# Altium project Audio_EDU_Mini.PrjPcb (part 1 of 3)
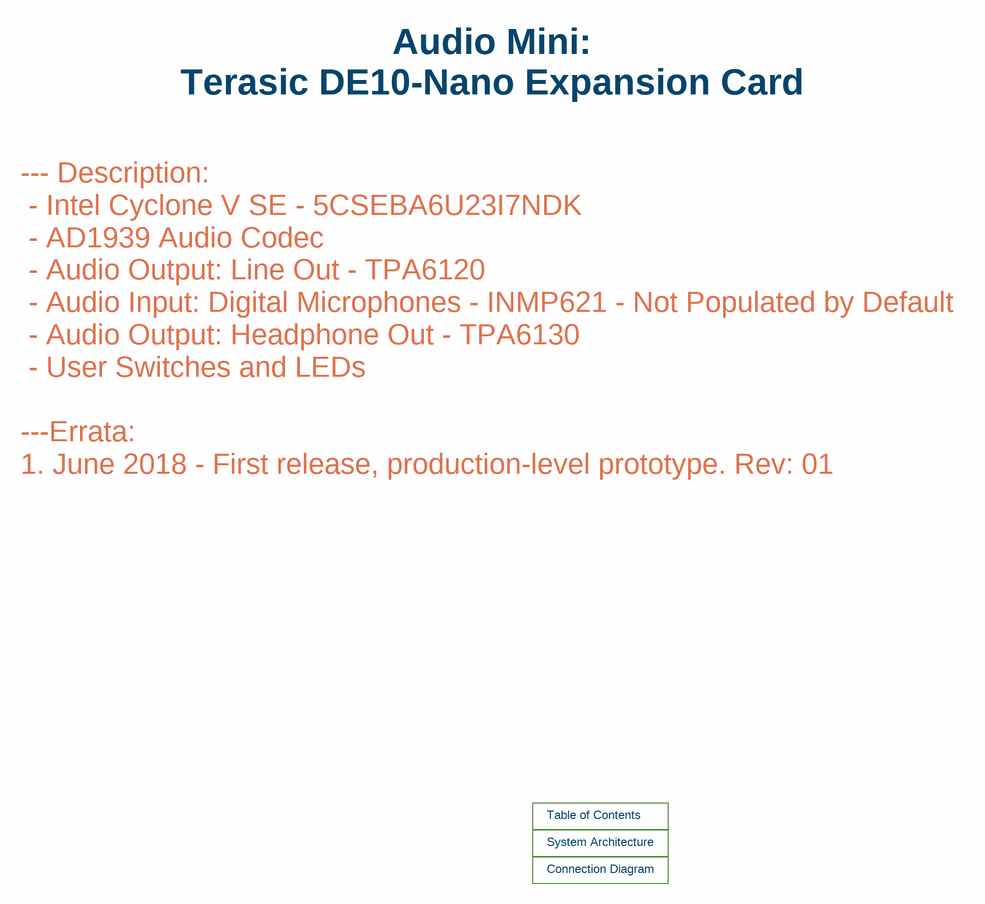
[diagram p0: Errata+TOC.SchDoc]
PCB_Name: Audio_Mini_Bare_PCB; PCB_Revision: 1.0
11 sheets, 134 parts. Net scope: flat (ports and power ports of the same name join across sheets).
Board file: Audio_EDU_Mini_Rev1_0.PcbDoc
Sheets:
  Errata+TOC.SchDoc
    Table of Contents = ToC.SchDoc
    Connection Diagram = TopLevel.SchDoc
      DIGITAL MICROPHONES* = Audio_Input_Digitial_Mic.SchDoc
      3.5mm HEADPHONE OUTPUT = Audio_Output_Headphone.SchDoc
      SUPPORT = Support.SchDoc
      FPGA CONNECTORS = FPGA_Connectors.SchDoc
      3.5mm LINE IN = Audio_Input_Line_In.SchDoc
      AUDIO CODEC = Audio_Codec.SchDoc
      POWER = Power.SchDoc
    System Architecture = System_Architecture.SchDoc

## Sheet Errata+TOC.SchDoc: Errata and Table of Contents
size 279 x 215 mm; DrawnBy: Connor Dack; Engineer: Connor Dack; DocumentNumber: 1; Revision: 1.0; SheetNumber: 1; SheetTotal: 11

### Sub-sheets
Connection Diagram = TopLevel.SchDoc: no entries
System Architecture = System_Architecture.SchDoc: no entries
Table of Contents = ToC.SchDoc: no entries

### Notes on the sheet
- Audio Mini:
  Terasic DE10-Nano Expansion Card
- --- Description:
  - Intel Cyclone V SE - 5CSEBA6U23I7NDK
  - AD1939 Audio Codec
  - Audio Output: Line Out - TPA6120
  - Audio Input: Digital Microphones - INMP621 - Not Populated by Default
  - Audio Output: Headphone Out - TPA6130
  - User Switches and LEDs
  ---Errata:
  1. June 2018 - First release, production-level prototype. Rev: 01
- Title:
- Rev:
- Sheet:
- Date:
- of
- Time:
- Size:
- 11 x 8.5 Inches
- Engineer:
- File:
- This document contains confidential and proprietary information belonging to flat earth of Bozeman, Montana.
  This information can not be disclosed to anyone outside of flat earth without written permission from flat earth.

## Sheet ToC.SchDoc: Table of Contents
size 279 x 215 mm; CompanyName: Flat Earth Inc.; DrawnBy: Connor Dack; Engineer: Connor Dack; Address1: 985 Technology Blvd; Address2: Suite 102; Address3: Bozeman, MT, 59718; DocumentNumber: 2; Revision: 0.0; SheetNumber: 2; SheetTotal: 11
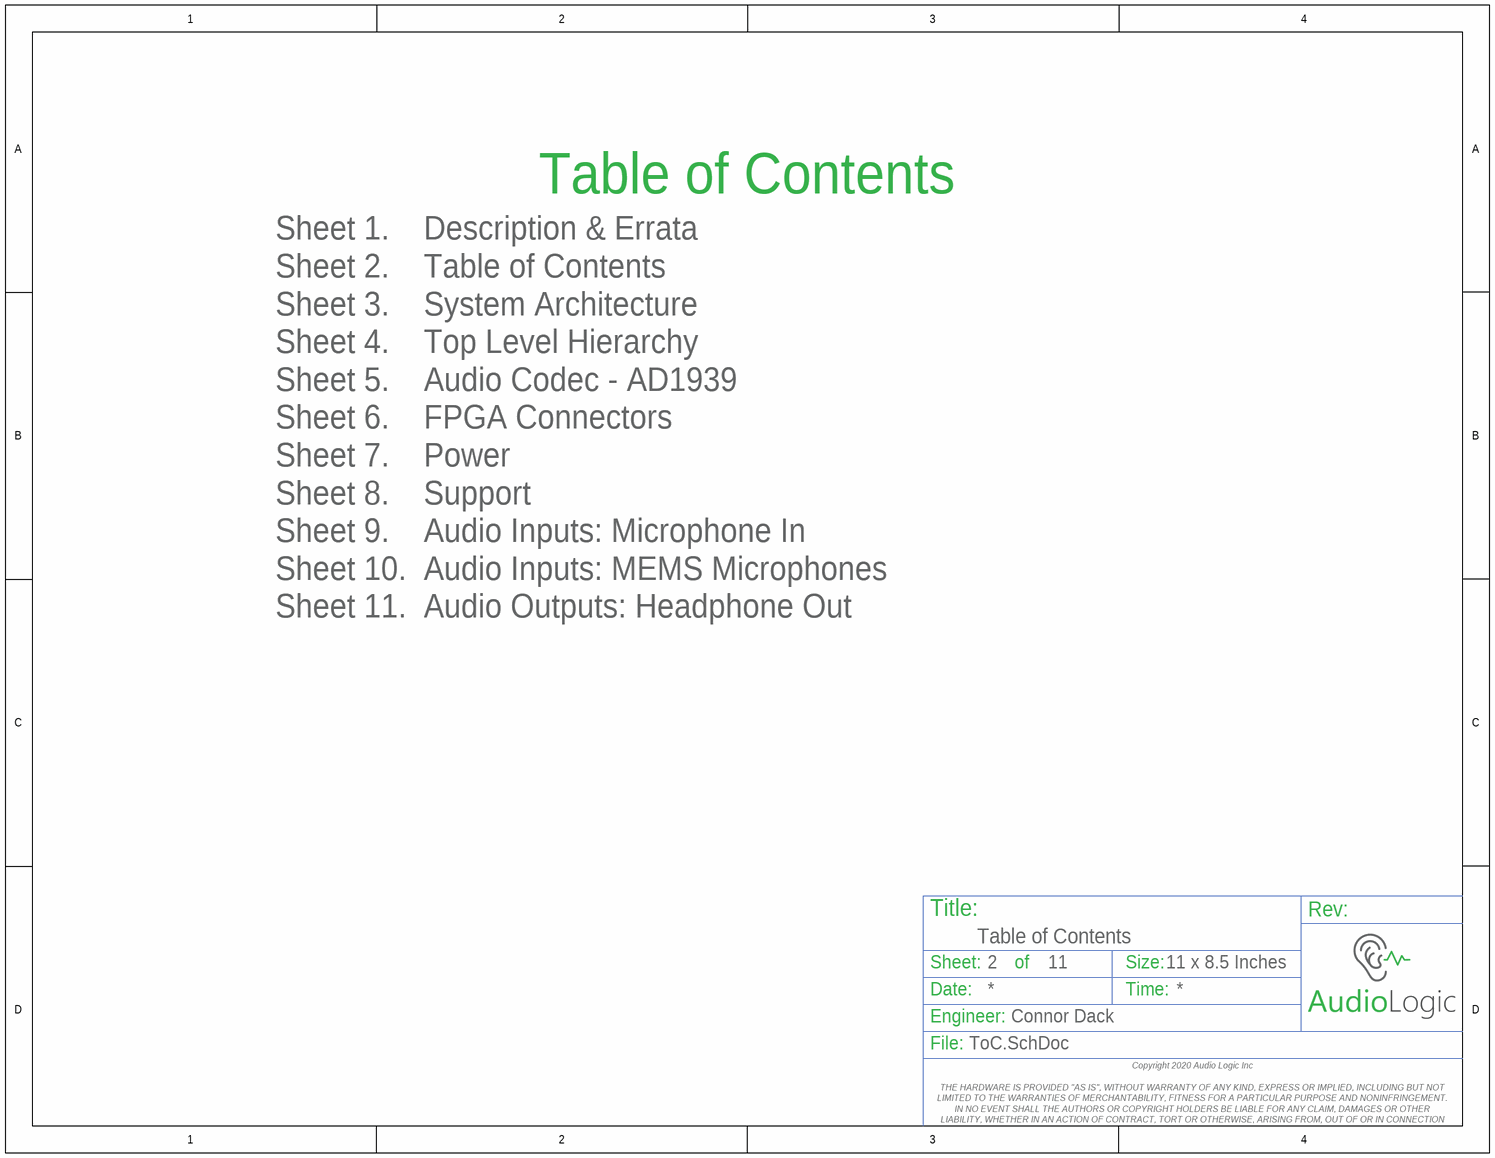
[diagram p1: ToC.SchDoc]

### Notes on the sheet
- Table of Contents
- Sheet 1.    Description & Errata
  Sheet 2.    Table of Contents
  Sheet 3.    System Architecture
  Sheet 4.    Top Level Hierarchy
  Sheet 5.    Audio Codec - AD1939
  Sheet 6.    FPGA Connectors
  Sheet 7.    Power
  Sheet 8.    Support
  Sheet 9.    Audio Inputs: Microphone In
  Sheet 10.  Audio Inputs: MEMS Microphones
  Sheet 11.  Audio Outputs: Headphone Out
- Title:
- Sheet:
- of
- Size:
- 11 x 8.5 Inches
- Rev:
- Date:
- Engineer:
- Time:
- File:
- Copyright 2020 Audio Logic Inc
  THE HARDWARE IS PROVIDED "AS IS", WITHOUT WARRANTY OF ANY KIND, EXPRESS OR IMPLIED, INCLUDING BUT NOT LIMITED TO THE WARRANTIES OF MERCHANTABILITY, FITNESS FOR A PARTICULAR PURPOSE AND NONINFRINGEMENT. IN NO EVENT SHALL THE AUTHORS OR COPYRIGHT HOLDERS BE LIABLE FOR ANY CLAIM, DAMAGES OR OTHER LIABILITY, WHETHER IN AN ACTION OF CONTRACT, TORT OR OTHERWISE, ARISING FROM, OUT OF OR IN CONNECTION WITH THE HARDWARE OR THE USE OR OTHER DEALINGS IN THE HARDWARE.

## Sheet TopLevel.SchDoc: Top Level Hierarchy
size 279 x 215 mm; DrawnBy: Connor Dack; DocumentNumber: 4; Revision: 1.0; SheetNumber: 4; SheetTotal: 11
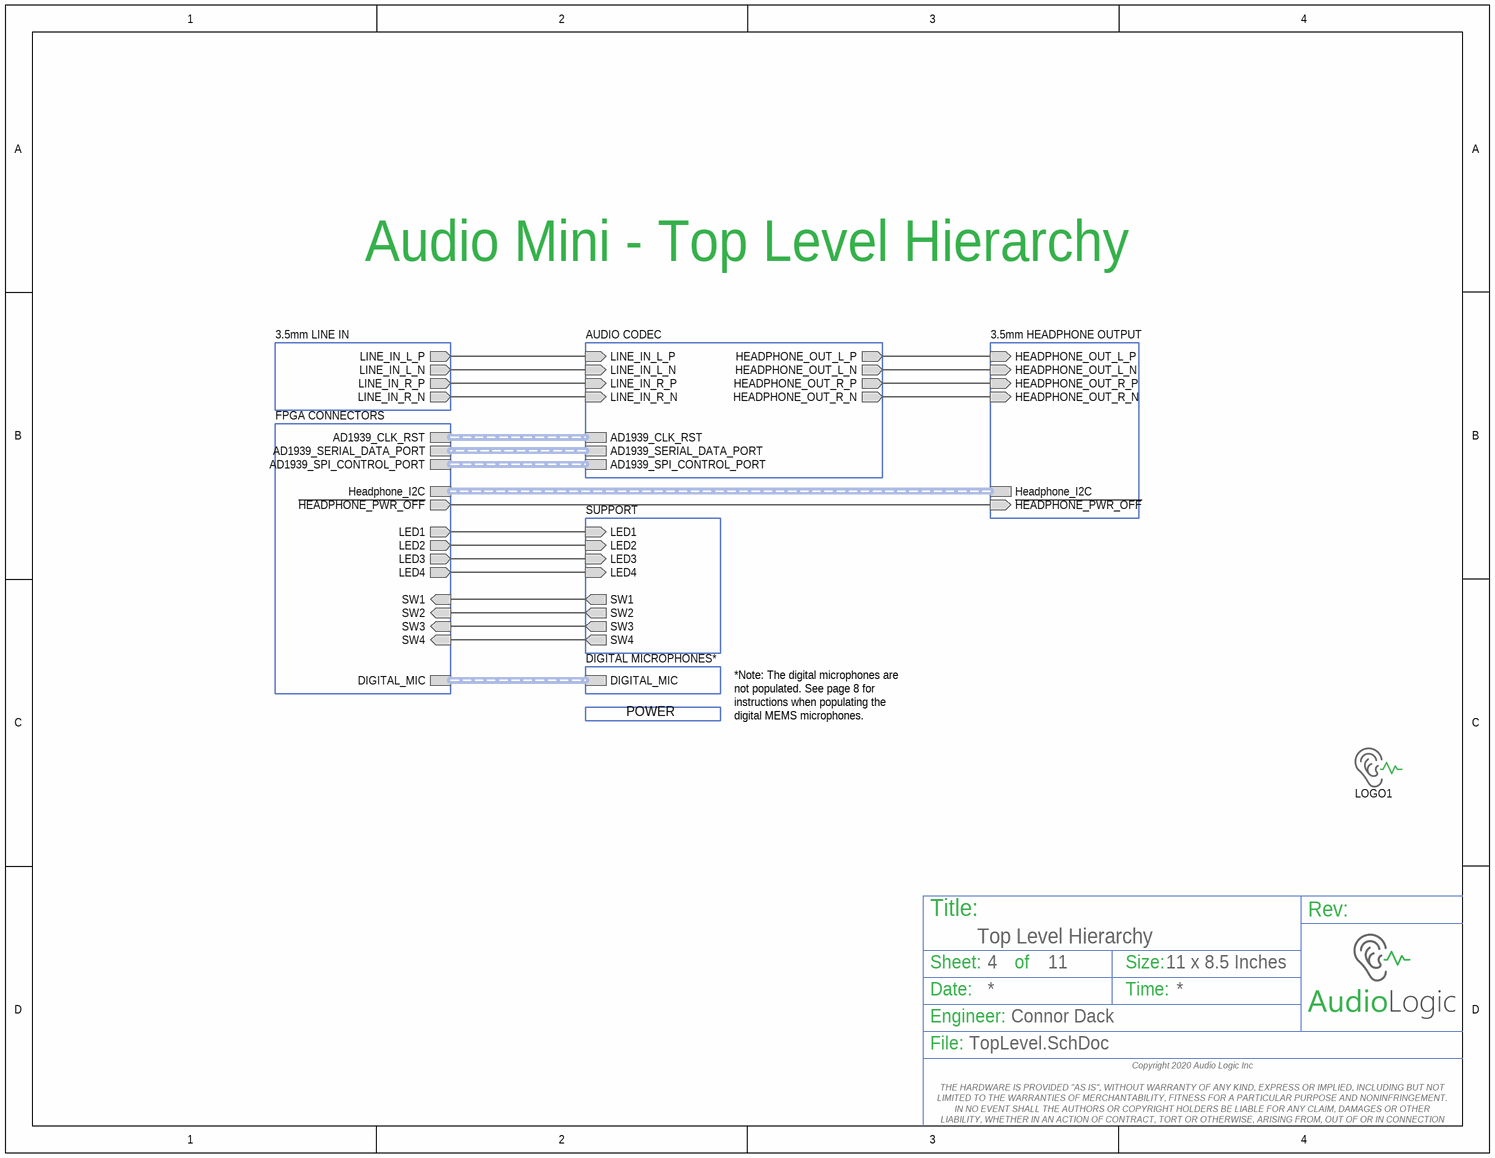
[diagram p2: TopLevel.SchDoc]

### Parts
LOGO1  Audio Logic Logo  [AL_Logo_Small_Silkscreen]  (value not drawn)  (no BOM)

### Sub-sheets
3.5mm HEADPHONE OUTPUT = Audio_Output_Headphone.SchDoc: HEADPHONE_OUT_R_N (in), HEADPHONE_OUT_R_P (in), HEADPHONE_OUT_L_N (in), HEADPHONE_OUT_L_P (in), ~{HEADPHONE_PWR_OFF} (in), Headphone_I2C (harness I2C_Headphone)
3.5mm LINE IN = Audio_Input_Line_In.SchDoc: LINE_IN_R_P (out), LINE_IN_R_N (out), LINE_IN_L_P (out), LINE_IN_L_N (out)
AUDIO CODEC = Audio_Codec.SchDoc: HEADPHONE_OUT_R_N (out), HEADPHONE_OUT_R_P (out), HEADPHONE_OUT_L_N (out), HEADPHONE_OUT_L_P (out), LINE_IN_R_P (in), LINE_IN_R_N (in), LINE_IN_L_P (in), LINE_IN_L_N (in), AD1939_CLK_RST (harness AD1939_CLK_RST), AD1939_SERIAL_DATA_PORT (harness AD19319_Serial_Data_Port), AD1939_SPI_CONTROL_PORT (harness SPI_Audio_Codec)
DIGITAL MICROPHONES* = Audio_Input_Digitial_Mic.SchDoc: DIGITAL_MIC (harness Digital_Mic)
FPGA CONNECTORS = FPGA_Connectors.SchDoc: SW1 (in), SW3 (in), SW2 (in), SW4 (in), LED1 (out), LED2 (out), LED3 (out), LED4 (out), DIGITAL_MIC (harness Digital_Mic), Headphone_I2C (harness I2C_Headphone), ~{HEADPHONE_PWR_OFF} (out), AD1939_SPI_CONTROL_PORT (harness SPI_Audio_Codec), AD1939_SERIAL_DATA_PORT (harness AD19319_Serial_Data_Port), AD1939_CLK_RST (harness AD1939_CLK_RST)
POWER = Power.SchDoc: no entries
SUPPORT = Support.SchDoc: SW1 (out), SW2 (out), SW3 (out), SW4 (out), LED1 (in), LED2 (in), LED3 (in), LED4 (in)

### Nets
(unnamed): sheet 3.5mm HEADPHONE OUTPUT/HEADPHONE_OUT_R_N, sheet AUDIO CODEC/HEADPHONE_OUT_R_N
(unnamed): sheet 3.5mm HEADPHONE OUTPUT/HEADPHONE_OUT_R_P, sheet AUDIO CODEC/HEADPHONE_OUT_R_P
(unnamed): sheet 3.5mm HEADPHONE OUTPUT/HEADPHONE_OUT_L_N, sheet AUDIO CODEC/HEADPHONE_OUT_L_N
(unnamed): sheet 3.5mm HEADPHONE OUTPUT/HEADPHONE_OUT_L_P, sheet AUDIO CODEC/HEADPHONE_OUT_L_P
(unnamed): sheet 3.5mm HEADPHONE OUTPUT/~{HEADPHONE_PWR_OFF}, sheet FPGA CONNECTORS/~{HEADPHONE_PWR_OFF}
(unnamed): sheet SUPPORT/SW1, sheet FPGA CONNECTORS/SW1
(unnamed): sheet SUPPORT/SW2, sheet FPGA CONNECTORS/SW2
(unnamed): sheet SUPPORT/SW3, sheet FPGA CONNECTORS/SW3
(unnamed): sheet SUPPORT/SW4, sheet FPGA CONNECTORS/SW4
(unnamed): sheet SUPPORT/LED1, sheet FPGA CONNECTORS/LED1
(unnamed): sheet SUPPORT/LED2, sheet FPGA CONNECTORS/LED2
(unnamed): sheet SUPPORT/LED3, sheet FPGA CONNECTORS/LED3
(unnamed): sheet SUPPORT/LED4, sheet FPGA CONNECTORS/LED4
(unnamed): sheet 3.5mm LINE IN/LINE_IN_R_P, sheet AUDIO CODEC/LINE_IN_R_P
(unnamed): sheet 3.5mm LINE IN/LINE_IN_R_N, sheet AUDIO CODEC/LINE_IN_R_N
(unnamed): sheet 3.5mm LINE IN/LINE_IN_L_P, sheet AUDIO CODEC/LINE_IN_L_P
(unnamed): sheet 3.5mm LINE IN/LINE_IN_L_N, sheet AUDIO CODEC/LINE_IN_L_N

### Buses and harness runs
harness sheet 3.5mm HEADPHONE OUTPUT/Headphone_I2C = sheet FPGA CONNECTORS/Headphone_I2C
harness sheet AUDIO CODEC/AD1939_CLK_RST = sheet FPGA CONNECTORS/AD1939_CLK_RST
harness sheet AUDIO CODEC/AD1939_SERIAL_DATA_PORT = sheet FPGA CONNECTORS/AD1939_SERIAL_DATA_PORT
harness sheet AUDIO CODEC/AD1939_SPI_CONTROL_PORT = sheet FPGA CONNECTORS/AD1939_SPI_CONTROL_PORT
harness sheet DIGITAL MICROPHONES*/DIGITAL_MIC = sheet FPGA CONNECTORS/DIGITAL_MIC

### Notes on the sheet
- Audio Mini - Top Level Hierarchy
- *Note: The digital microphones are not populated. See page 8 for instructions when populating the digital MEMS microphones.
- Title:
- Sheet:
- of
- Size:
- 11 x 8.5 Inches
- Rev:
- Date:
- Engineer:
- Time:
- File:
- Copyright 2020 Audio Logic Inc
  THE HARDWARE IS PROVIDED "AS IS", WITHOUT WARRANTY OF ANY KIND, EXPRESS OR IMPLIED, INCLUDING BUT NOT LIMITED TO THE WARRANTIES OF MERCHANTABILITY, FITNESS FOR A PARTICULAR PURPOSE AND NONINFRINGEMENT. IN NO EVENT SHALL THE AUTHORS OR COPYRIGHT HOLDERS BE LIABLE FOR ANY CLAIM, DAMAGES OR OTHER LIABILITY, WHETHER IN AN ACTION OF CONTRACT, TORT OR OTHERWISE, ARISING FROM, OUT OF OR IN CONNECTION WITH THE HARDWARE OR THE USE OR OTHER DEALINGS IN THE HARDWARE.

### Library data of the parts
LOGO1 = Audio_Logic_Logo

## Sheet Audio_Input_Digitial_Mic.SchDoc: MEMS Microphones
size 279 x 215 mm; DrawnBy: Connor Dack; Engineer: Connor Dack; DocumentNumber: 10; Revision: 1.0; SheetNumber: 10; SheetTotal: 11
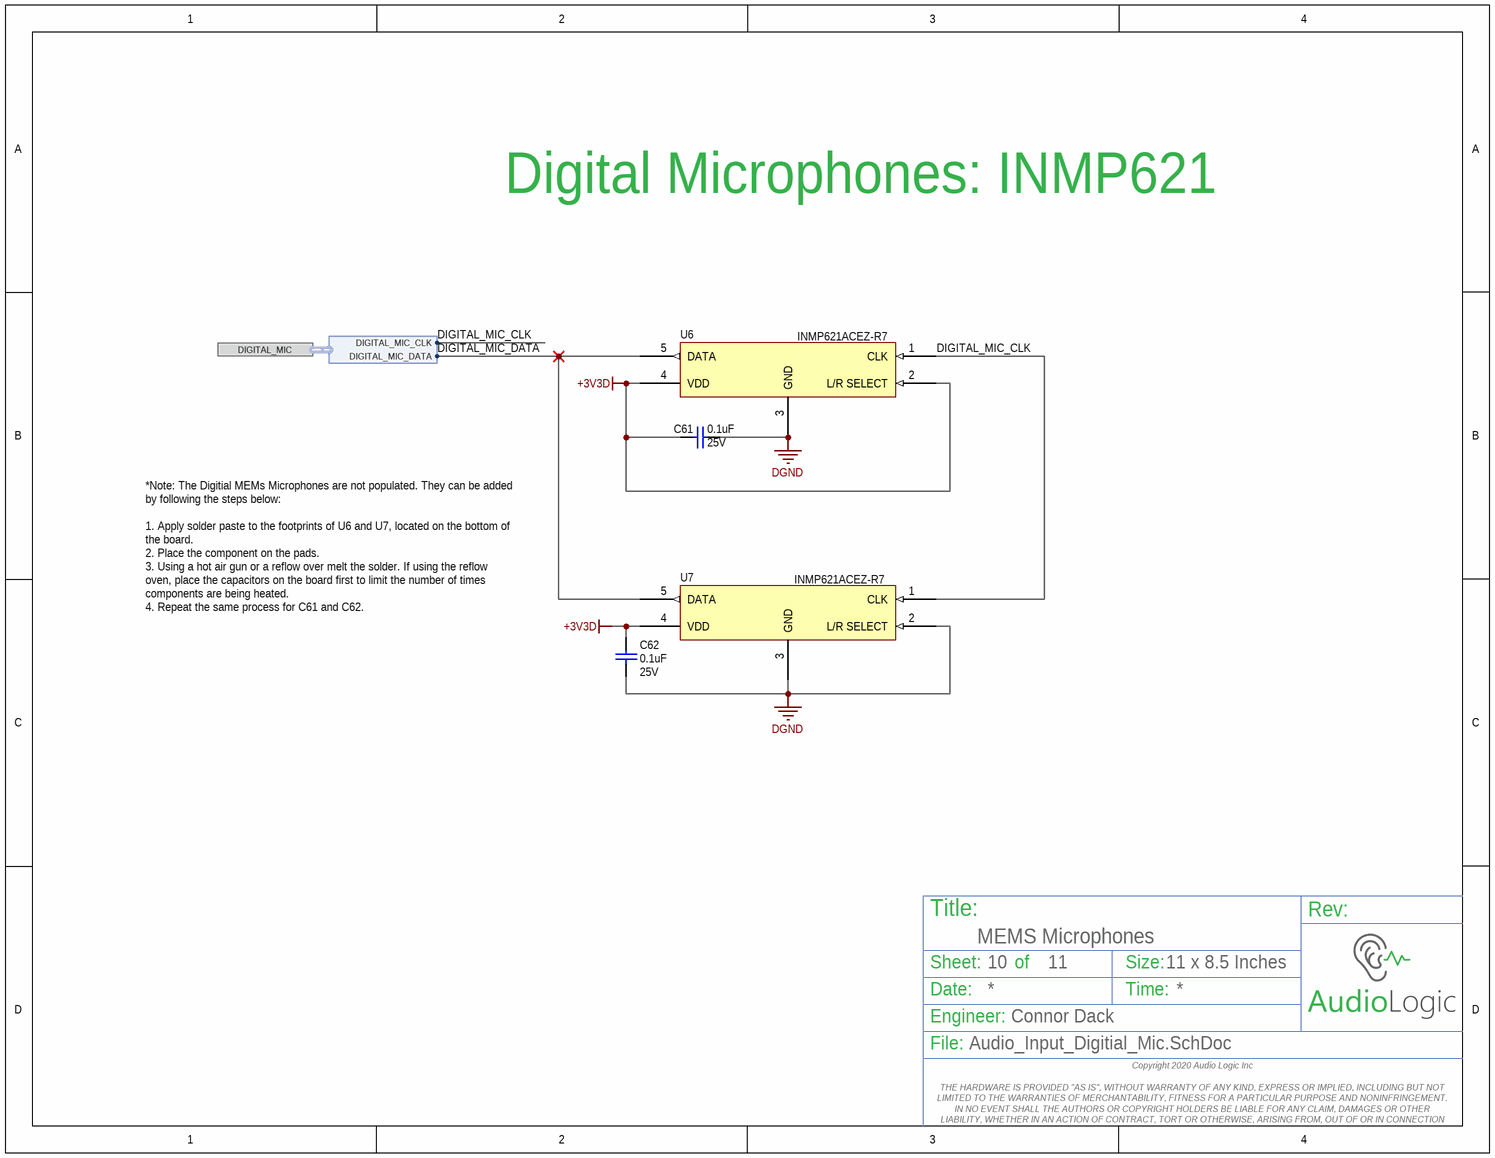
[diagram p3: Audio_Input_Digitial_Mic.SchDoc]

### Parts
C61  Voltage Rating: 25V  Capacitance: 0.1uF  [3-0603_L_DNP]  (hidden comment: CGA3E2X7R1E104K080AA)
C62  Voltage Rating: 25V  Capacitance: 0.1uF  [3-0603_L_DNP]  (hidden comment: CGA3E2X7R1E104K080AA)
U6  Manufacturer Part Number: INMP621ACEZ-R7  [INMP621_DNP]  (hidden comment: INMP621)
U7  Manufacturer Part Number: INMP621ACEZ-R7  [INMP621_DNP]  (hidden comment: INMP621)

### Ports
DIGITAL_MIC (harness Digital_Mic)

### Harnesses
Digital_Mic: DIGITAL_MIC_CLK, DIGITAL_MIC_DATA

### Nets
+3V3D: C61.2 C62.1 U6.2(L/R_SELECT) U6.4(VDD) U7.4(VDD)
DGND: C61.1 C62.2 U6.3(GND) U7.2(L/R_SELECT) U7.3(GND)  [project net AGND]
DIGITAL_MIC_CLK: U6.1(CLK) U7.1(CLK) ; port DIGITAL_MIC.DIGITAL_MIC_CLK
DIGITAL_MIC_DATA: U6.5(DATA) U7.5(DATA) ; port DIGITAL_MIC.DIGITAL_MIC_DATA

### Notes on the sheet
- Digital Microphones: INMP621
- *Note: The Digitial MEMs Microphones are not populated. They can be added by following the steps below:
  1. Apply solder paste to the footprints of U6 and U7, located on the bottom of the board.
  2. Place the component on the pads.
  3. Using a hot air gun or a reflow over melt the solder. If using the reflow oven, place the capacitors on the board first to limit the number of times components are being heated.
  4. Repeat the same process for C61 and C62.
- Title:
- Sheet:
- of
- Size:
- 11 x 8.5 Inches
- Rev:
- Date:
- Engineer:
- Time:
- File:
- Copyright 2020 Audio Logic Inc
  THE HARDWARE IS PROVIDED "AS IS", WITHOUT WARRANTY OF ANY KIND, EXPRESS OR IMPLIED, INCLUDING BUT NOT LIMITED TO THE WARRANTIES OF MERCHANTABILITY, FITNESS FOR A PARTICULAR PURPOSE AND NONINFRINGEMENT. IN NO EVENT SHALL THE AUTHORS OR COPYRIGHT HOLDERS BE LIABLE FOR ANY CLAIM, DAMAGES OR OTHER LIABILITY, WHETHER IN AN ACTION OF CONTRACT, TORT OR OTHERWISE, ARISING FROM, OUT OF OR IN CONNECTION WITH THE HARDWARE OR THE USE OR OTHER DEALINGS IN THE HARDWARE.

### Library data of the parts
C61 C62 = CGA3E2X7R1E104K080AA: CAP CER 0.1UF 25V X7R 0603; Manufacturer: TDK; Tolerance: 10%; ComponentLink1URL: https://datasheet.ciiva.com/24218/cga3e2x7r1h332k080aa-266003-24218741.pdf; ComponentLink1Description: https://datasheet.ciiva.com/24218/cga3e2x7r1h332k080aa-266003-24218741.pdf; Supplier 1: Digi-Key; Manufacturer Part Number: CGA3E2X7R1E104K080AA; Stock 1: 170098; Pricing 1: 1=0.1, 10=0.063, 100=0.0279, 500=0.0199, 1000=0.0156 (USD); Mount: Surface Mount; Case/Package: 0603; Weight: 7.1E-05oz; Case Code (Metric): 1608; Case Code (Imperial): 0603; Min Operating Temperature: -55°C; Max Operating Temperature: 125°C; Packaging: Tape and Reel; Package Quantity: 1; Voltage Rating (DC): 25V; Dielectric: X7R; Termination: SMD/SMT; Composition: Ceramic; Length: 1.6mm; Height: 0.8mm; Width: 0.031inch; Thickness: 0.035inch; Depth: 0.8mm; REACH SVHC: No SVHC; Lead Free: Lead Free; ComponentLink2URL: https://datasheet.ciiva.com/22725/1735392-22725638.pdf; ComponentLink2Description: https://datasheet.ciiva.com/22725/1735392-22725638.pdf; ComponentLink3URL: https://datasheet.ciiva.com/24220/cga3e2x7r1e104k080aa-265934-24220022.pdf; ComponentLink3Description: https://datasheet.ciiva.com/24220/cga3e2x7r1e104k080aa-265934-24220022.pdf; ComponentLink4URL: https://datasheet.ciiva.com/22725/1735392-22725639.pdf; ComponentLink4Description: https://datasheet.ciiva.com/22725/1735392-22725639.pdf; ComponentLink5URL: https://datasheet.ciiva.com/16427/mlccspec-automotive-general-midvoltage-en-16427320.pdf; ComponentLink5Description: https://datasheet.ciiva.com/16427/mlccspec-automotive-general-midvoltage-en-16427320.pdf; ComponentLink6URL: https://datasheet.ciiva.com/23803/1735392-23803082.pdf; ComponentLink6Description: https://datasheet.ciiva.com/23803/1735392-23803082.pdf; Supplier Part Number 1: 445-5667-6-ND; Load Status: *
U6 U7 = INMP621: 45Hz ~ 20kHz Digital, PDM Microphone MEMS (Silicon) Omnidirectional (-46dB ±2dB @ 94dB SPL) Solder Pads; Manufacturer: InvenSense; S/N Ratio: 65dB; Voltage Range: 1.62 ~ 3.63V; Current - Supply: 1.6mA; Port Location: Bottom; Seal Rating: None; Shape: Rectangular; Supplier 1: Digi-Key; RoHS: RoHS Compliant; Category: Audio Products; Stock 1: 1211; Pricing 1: 1=2.88, 10=2.491, 25=2.2292, 50=1.9668, 100=1.9012, 250=1.83568, 500=1.77012 (USD); Packaging: Cut Tape (CT); Part Status: Active; Type: MEMS (Silicon); Output Type: Digital, PDM; Direction: Omnidirectional; Frequency Range: 45Hz ~ 20kHz; Sensitivity: -46dB ±2dB @ 94dB SPL; Impedance: -; Voltage - Rated: -; Termination: Solder Pads; Size / Dimension: 4.00mm L x 3.00mm W; Height (Max): 1.10mm; ComponentLink1URL: https://www.invensense.com/wp-content/uploads/2015/02/INMP621.pdf; ComponentLink1Description: https://www.invensense.com/wp-content/uploads/2015/02/INMP621.pdf; Supplier Part Number 1: 1428-1018-1-ND; Load Status: *

## Sheet Audio_Output_Headphone.SchDoc: Heaphone Out
size 279 x 215 mm; DrawnBy: Connor Dack; Engineer: Connor Dack; DocumentNumber: 11; Revision: 1.0; SheetNumber: 11; SheetTotal: 11
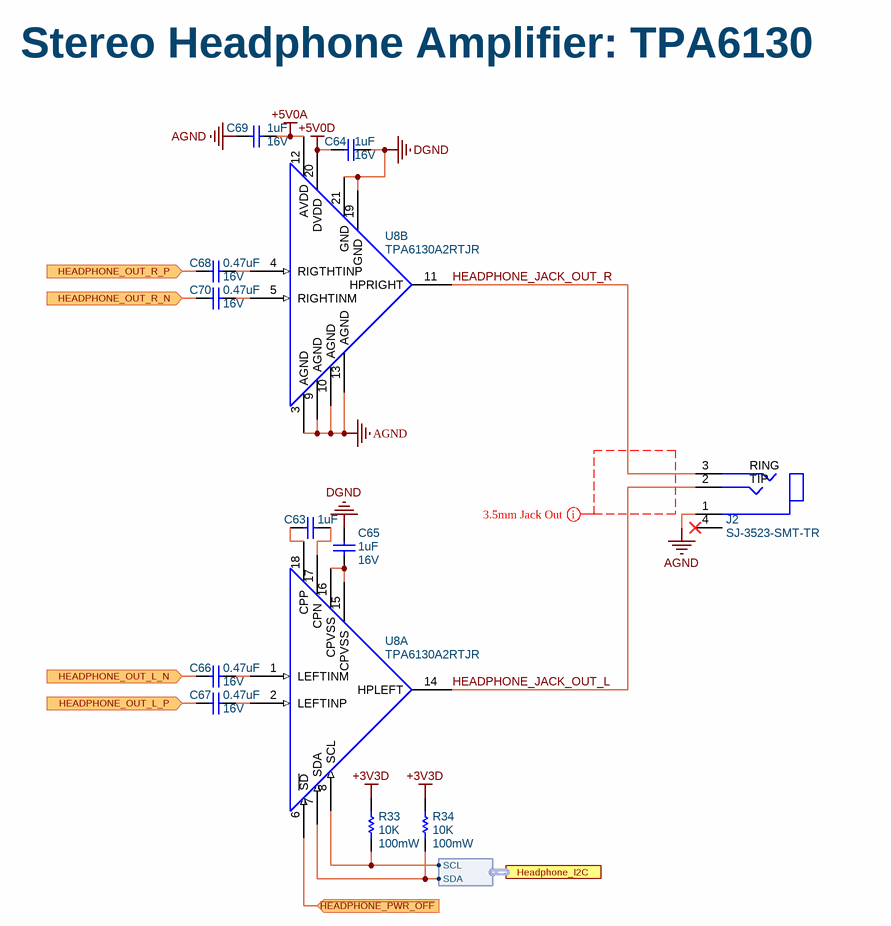
[diagram p4: Audio_Output_Headphone.SchDoc]

### Parts
C63  Capacitance: 1uF  [3-0603_L]  (hidden comment: CGA3E1X7R1C105M080AC)
C64  Voltage Rating: 16V  Capacitance: 1uF  [3-0603_L]  (hidden comment: CGA3E1X7R1C105M080AC)
C65  Voltage Rating: 16V  Capacitance: 1uF  [3-0603_L]  (hidden comment: CGA3E1X7R1C105M080AC)
C66  Voltage Rating: 16V  Capacitance: 0.47uF  [3-0603_L]  (hidden comment: CGA3E1X7R1C474M080AC)
C67  Voltage Rating: 16V  Capacitance: 0.47uF  [3-0603_L]  (hidden comment: CGA3E1X7R1C474M080AC)
C68  Voltage Rating: 16V  Capacitance: 0.47uF  [3-0603_L]  (hidden comment: CGA3E1X7R1C474M080AC)
C69  Voltage Rating: 16V  Capacitance: 1uF  [3-0603_L]  (hidden comment: CGA3E1X7R1C105M080AC)
C70  Voltage Rating: 16V  Capacitance: 0.47uF  [3-0603_L]  (hidden comment: CGA3E1X7R1C474M080AC)
J2  SJ-3523-SMT-TR  [SJ-3523-SMT-TR]
R33  Power (Watts): 100mW  Resistance (Ohms): 10K  [3-0603_R_L_DNP]  (hidden comment: ERJ-3GEYJ103V)
R34  Power (Watts): 100mW  Resistance (Ohms): 10K  [3-0603_R_L_DNP]  (hidden comment: ERJ-3GEYJ103V)
U8  TPA6130A2RTJR  [QFN50P400X400X80_HS-21N]  (parts A,B of 2)

### Ports
Headphone_I2C (harness I2C_Headphone), HEADPHONE_OUT_L_N (in), HEADPHONE_OUT_L_P (in), HEADPHONE_OUT_R_N (in), HEADPHONE_OUT_R_P (in), ~{HEADPHONE_PWR_OFF} (in)

### Harnesses
I2C_Headphone: SDA, SCL

### Nets
+3V3D: R33.2 R34.2
+5V0A: C69.2 U8.12(AVDD)
+5V0D: C64.1 U8.20(DVDD)
AGND: C64.2 C65.2 C69.1 J2.1(Sleeve) U8.3(AGND) U8.9(AGND) U8.10(AGND) U8.13(AGND) U8.19(GND) U8.21(GND)  [also labelled DGND]
~{HEADPHONE_PWR_OFF}: U8.6(~{SD}) ; port ~{HEADPHONE_PWR_OFF}
HEADPHONE_JACK_OUT_L: J2.2(Tip) U8.14(HPLEFT)
HEADPHONE_JACK_OUT_R: J2.3(Ring) U8.11(HPRIGHT)
HEADPHONE_OUT_L_N: C66.1 ; port HEADPHONE_OUT_L_N
HEADPHONE_OUT_L_P: C67.1 ; port HEADPHONE_OUT_L_P
HEADPHONE_OUT_R_N: C70.1 ; port HEADPHONE_OUT_R_N
HEADPHONE_OUT_R_P: C68.1 ; port HEADPHONE_OUT_R_P
NetC63_1: C63.1 U8.18(CPP)
NetC63_2: C63.2 U8.17(CPN)
NetC65_1: C65.1 U8.15(CPVSS) U8.16(CPVSS)
NetC66_2: C66.2 U8.1(LEFTINM)
NetC67_2: C67.2 U8.2(LEFTINP)
NetC68_2: C68.2 U8.4(RIGTHTINP)
NetC70_2: C70.2 U8.5(RIGHTINM)
NetJP7_2: R33.1 U8.8(SCL) ; port Headphone_I2C.SCL
NetJP7_4: R34.1 U8.7(SDA) ; port Headphone_I2C.SDA

Not connected (* = marked no-connect by the designer): J2 4(NC)*

### Layout directives
net class 3.5mm Jack Out: (no net found under the mark)

### Notes on the sheet
- Stereo Headphone Amplifier: TPA6130
- Title:
- Rev:
- Sheet:
- Date:
- of
- Time:
- Size:
- 11 x 8.5 Inches
- Engineer:
- File:
- This document contains confidential and proprietary information belonging to flat earth of Bozeman, Montana.
  This information can not be disclosed to anyone outside of flat earth without written permission from flat earth.
- (in symbol SJ-3523-SMT-TR) RING; TIP

### Library data of the parts
C63-C65 C69 = CGA3E1X7R1C105M080AC: CAP CER 1UF 16V X7R 0603; Manufacturer: TDK; Tolerance: 20%; Supplier 1: Digi-Key; Manufacturer Part Number: CGA3E1X7R1C105M080AC; Stock 1: 18034; Pricing 1: 1=0.14, 10=0.1, 100=0.0468, 500=0.0328, 1000=0.0272 (USD); Mount: Surface Mount; Case/Package: 0603; Weight: 7.1E-05oz; Case Code (Metric): 1608; Case Code (Imperial): 0603; Min Operating Temperature: -55°C; Max Operating Temperature: 125°C; Package Quantity: 4000; Packaging: Tape and Reel; Dielectric: X7R; Termination: SMD/SMT; Voltage Rating (DC): 16V; Length: 0.063inch; Height: 0.8mm; Width: 0.031inch; Thickness: 0.035inch; Lead Free: Lead Free; ComponentLink1URL: https://product.tdk.com/info/en/catalog/datasheets/mlcc_automotive_general_en.pdf; ComponentLink1Description: https://product.tdk.com/info/en/catalog/datasheets/mlcc_automotive_general_en.pdf; ComponentLink2URL: http://product.tdk.com/capacitor/mlcc/detailed_information.php?lang=en&ref=jp&part_no=CGA3E1X7R1C105M080AC; ComponentLink2Description: http://product.tdk.com/capacitor/mlcc/detailed_information.php?lang=en&ref=jp&part_no=CGA3E1X7R1C105M080AC; ComponentLink3URL: http://product.tdk.com/en/catalog/datasheets/mlcc_automotive_general_en.pdf; ComponentLink3Description: http://product.tdk.com/en/catalog/datasheets/mlcc_automotive_general_en.pdf; Supplier Part Number 1: 445-12540-6-ND
  C63: Voltage Rating: 16V
C66-C68 C70 = CGA3E1X7R1C474M080AC: CAP CER 0.47UF 16V X7R 0603; Manufacturer: TDK; Tolerance: 20%; Supplier 1: Digi-Key; Manufacturer Part Number: CGA3E1X7R1C474M080AC; Stock 1: 6138; Pricing 1: 1=0.18, 10=0.129, 100=0.0605, 500=0.0424, 1000=0.0351 (USD); Mount: Surface Mount; Case/Package: 0603; Weight: 7.1E-05oz; Case Code (Metric): 1608; Case Code (Imperial): 0603; Min Operating Temperature: -55°C; Max Operating Temperature: 125°C; Package Quantity: 4000; Packaging: Tape and Reel; Dielectric: X7R; Voltage Rating (DC): 16V; Length: 0.063inch; Height: 0.8mm; Width: 0.031inch; Thickness: 0.035inch; ComponentLink1URL: https://product.tdk.com/info/en/catalog/datasheets/mlcc_automotive_general_en.pdf; ComponentLink1Description: https://product.tdk.com/info/en/catalog/datasheets/mlcc_automotive_general_en.pdf; ComponentLink2URL: http://product.tdk.com/capacitor/mlcc/detailed_information.php?lang=en&ref=jp&part_no=CGA3E1X7R1C474M080AC; ComponentLink2Description: http://product.tdk.com/capacitor/mlcc/detailed_information.php?lang=en&ref=jp&part_no=CGA3E1X7R1C474M080AC; ComponentLink3URL: http://product.tdk.com/en/catalog/datasheets/mlcc_automotive_general_en.pdf; ComponentLink3Description: http://product.tdk.com/en/catalog/datasheets/mlcc_automotive_general_en.pdf; Supplier Part Number 1: 445-12537-6-ND
J2 = SJ-3523-SMT-TR: 3.50mm (0.141", 1/8", Mini Plug) - Headphone Phone Jack Stereo Connector Solder; Manufacturer: CUI Inc.; Gender: Female; Actual Diameter: 0.142" (3.60mm); Number of Positions/Contacts: 3 Conductors, 3 Contacts; Internal Switch(s): Does Not Contain Switch; Shielding: Unshielded; Voltage - Rated: 12VDC; Current Rating: 1A; Mating Length/Depth: 0.551" (14.00mm); Body Color: Black; Includes: 1 pc - 1 Connector; LatestRevisionDate: 17-Jul-2002; LatestRevisionNote: Re-released for DXP Platform.; Publisher: Altium Limited; Supplier 1: Digi-Key; RoHS: RoHS Compliant; Category: Connectors, Interconnects; Stock 1: 104981; Pricing 1: 1=1.34, 10=1.043, 100=0.7961, 500=0.63558 (USD); Packaging: Cut Tape (CT); Part Status: Active; Connector Type: Phone Jack; Signal Lines: Stereo; Industry Recognized Mating Diameter: 3.50mm (0.141", 1/8", Mini Plug) - Headphone; Mounting Type: Surface Mount, Right Angle; Termination: Solder; Features: Board Guide; Insulation Color: -; Contact Material - Plating: Silver; Body Material: -; ComponentLink1URL: http://www.cui.com/product/resource/digikeypdf/sj-352x-smt_series.pdf; ComponentLink1Description: http://www.cui.com/product/resource/digikeypdf/sj-352x-smt_series.pdf; Supplier Part Number 1: CP-3523SJCT-ND; Manufacturer Part Number: SJ-3523-SMT-TR
R33 R34 = ERJ-3GEYJ103V: RES 10K OHM 1/10W 5% 0603 SMD; Manufacturer: Panasonic - ECG; Temperature Coefficient: ±200ppm/°C; Supplier 1: Digi-Key; Manufacturer Part Number: ERJ-3GEYJ103V; RoHS: RoHS Compliant; Category: Resistors; Stock 1: 16219504; Pricing 1: 1=0.02, 50=0.0092, 100=0.007, 250=0.0052, 500=0.00384, 1000=0.00256 (USD); Composition: Thick Film; Features: -; Tolerance: ±5%; Package / Case: 0603 (1608 Metric); Size / Dimension: 0.063" L x 0.031" W (1.60mm x 0.80mm); Height: 0.022" (0.55mm); Number of Terminations: 2; Packaging: Cut Tape (CT); ComponentLink1URL: http://industrial.panasonic.com/www-cgi/jvcr13pz.cgi?E+PZ+3+AOA0001+ERJ3GEYJ103V+7+WW; ComponentLink1Description: http://industrial.panasonic.com/www-cgi/jvcr13pz.cgi?E+PZ+3+AOA0001+ERJ3GEYJ103V+7+WW; Supplier Part Number 1: P10KGCT-ND; Load Status: *
U8 = TPA6130A2RTJR: Amplifier IC Headphones, 2-Channel (Stereo) Class AB 20-QFN (4x4); Manufacturer: Texas Instruments; Max Output Power x Channels @ Load: 290mW x 1 @ 16 Ohm; 138mW x 2 @ 16 Ohm; Voltage - Supply: 2.5 V ~ 5.5 V; LatestRevisionDate: 17-Jul-2002; LatestRevisionNote: Re-released for DXP Platform.; Publisher: Altium Limited; Supplier 1: Digi-Key; RoHS: RoHS Compliant; Category: Integrated Circuits (ICs); Stock 1: 15763; Pricing 1: 1=2.19, 10=1.966, 100=1.5768, 500=1.296, 1000=0.9 (USD); Packaging: Cut Tape (CT); Part Status: Active; Type: Class AB; Output Type: Headphones, 2-Channel (Stereo); Features: Depop, Differential Inputs, I²C, Mute, Short-Circuit and Thermal Protection, Shutdown, Volume Control; Mounting Type: Surface Mount; Operating Temperature: -40°C ~ 85°C (TA); Supplier Device Package: 20-QFN (4x4); Package / Case: 20-WFQFN Exposed Pad; ComponentLink1URL: http://www.ti.com/lit/ds/symlink/tpa6130a2.pdf; ComponentLink1Description: http://www.ti.com/lit/ds/symlink/tpa6130a2.pdf; Supplier Part Number 1: 296-21656-1-ND; Manufacturer Part Number: TPA6130A2RTJR

## Sheet Support.SchDoc: Support
size 279 x 215 mm; DrawnBy: Connor Dack; Engineer: Connor Dack; DocumentNumber: 8; Revision: 1.0; SheetNumber: 8; SheetTotal: 11
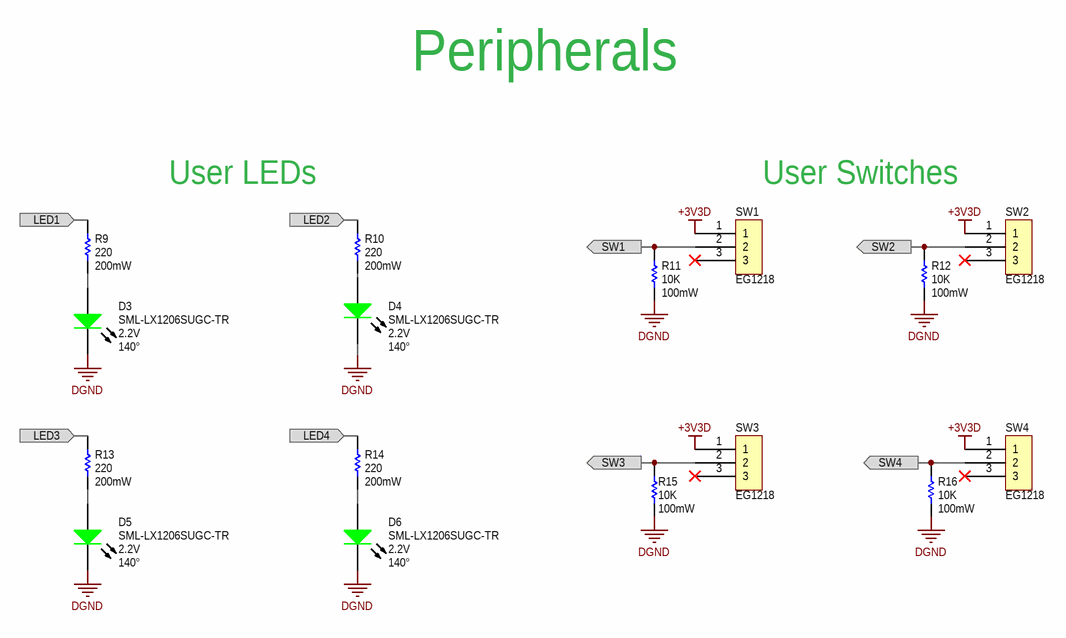
[diagram p5: Support.SchDoc]

### Parts
D3  Manufacturer Part Number: SML-LX1206SUGC-TR  Voltage - Forward (Vf) Typ: 2.2V  Viewing Angle: 140°  [DIOCP3216X11L]  (hidden comment: LED_GREEN 2)
D4  Manufacturer Part Number: SML-LX1206SUGC-TR  Voltage - Forward (Vf) Typ: 2.2V  Viewing Angle: 140°  [DIOCP3216X11L]  (hidden comment: LED_GREEN 2)
D5  Manufacturer Part Number: SML-LX1206SUGC-TR  Voltage - Forward (Vf) Typ: 2.2V  Viewing Angle: 140°  [DIOCP3216X11L]  (hidden comment: LED_GREEN 2)
D6  Manufacturer Part Number: SML-LX1206SUGC-TR  Voltage - Forward (Vf) Typ: 2.2V  Viewing Angle: 140°  [DIOCP3216X11L]  (hidden comment: LED_GREEN 2)
R9  Power (Watts): 200mW  Resistance (Ohms): 220  [3-0603_R_L]  (hidden comment: ERJ-PB3B2200V)
R10  Power (Watts): 200mW  Resistance (Ohms): 220  [3-0603_R_L]  (hidden comment: ERJ-PB3B2200V)
R11  Power (Watts): 100mW  Resistance (Ohms): 10K  [3-0603_R_L]  (hidden comment: ERJ-3GEYJ103V)
R12  Power (Watts): 100mW  Resistance (Ohms): 10K  [3-0603_R_L]  (hidden comment: ERJ-3GEYJ103V)
R13  Power (Watts): 200mW  Resistance (Ohms): 220  [3-0603_R_L]  (hidden comment: ERJ-PB3B2200V)
R14  Power (Watts): 200mW  Resistance (Ohms): 220  [3-0603_R_L]  (hidden comment: ERJ-PB3B2200V)
R15  Power (Watts): 100mW  Resistance (Ohms): 10K  [3-0603_R_L]  (hidden comment: ERJ-3GEYJ103V)
R16  Power (Watts): 100mW  Resistance (Ohms): 10K  [3-0603_R_L]  (hidden comment: ERJ-3GEYJ103V)
SW1  Slide Switch SPDT Through Hole  [EG1218]  (value not drawn)
SW2  Slide Switch SPDT Through Hole  [EG1218]  (value not drawn)
SW3  Slide Switch SPDT Through Hole  [EG1218]  (value not drawn)
SW4  Slide Switch SPDT Through Hole  [EG1218]  (value not drawn)

### Ports
LED1 (in), LED2 (in), LED3 (in), LED4 (in), SW1 (out), SW2 (out), SW3 (out), SW4 (out)

### Nets
+3V3D: SW1.1 SW2.1 SW3.1 SW4.1
DGND: D3.2(K) D4.2(K) D5.2(K) D6.2(K) R11.2 R12.2 R15.2 R16.2  [project net AGND]
LED1: R9.2 ; port LED1
LED2: R10.2 ; port LED2
LED3: R13.2 ; port LED3
LED4: R14.2 ; port LED4
SW1: R11.1 SW1.2 ; port SW1
SW2: R12.1 SW2.2 ; port SW2
SW3: R15.1 SW3.2 ; port SW3
SW4: R16.1 SW4.2 ; port SW4
NetD3_1: D3.1(A) R9.1
NetD4_1: D4.1(A) R10.1
NetD5_1: D5.1(A) R13.1
NetD6_1: D6.1(A) R14.1

Not connected (* = marked no-connect by the designer): SW1 3*; SW2 3*; SW3 3*; SW4 3*

### Notes on the sheet
- Peripherals
- User LEDs
- User Switches
- Title:
- Sheet:
- of
- Size:
- 11 x 8.5 Inches
- Rev:
- Date:
- Engineer:
- Time:
- File:
- Copyright 2020 Audio Logic Inc
  THE HARDWARE IS PROVIDED "AS IS", WITHOUT WARRANTY OF ANY KIND, EXPRESS OR IMPLIED, INCLUDING BUT NOT LIMITED TO THE WARRANTIES OF MERCHANTABILITY, FITNESS FOR A PARTICULAR PURPOSE AND NONINFRINGEMENT. IN NO EVENT SHALL THE AUTHORS OR COPYRIGHT HOLDERS BE LIABLE FOR ANY CLAIM, DAMAGES OR OTHER LIABILITY, WHETHER IN AN ACTION OF CONTRACT, TORT OR OTHERWISE, ARISING FROM, OUT OF OR IN CONNECTION WITH THE HARDWARE OR THE USE OR OTHER DEALINGS IN THE HARDWARE.

### Library data of the parts
D3-D6 = LED_GREEN 2: LED ALINGAP ULT GRN CLR 1206 SMD; Manufacturer: Lumex Opto/Components Inc; Color: Green; Millicandela Rating: 45mcd; Current - Test: 20mA; Wavelength - Peak: 574nm; Lens Type: Clear; Lens Style/Size: Rectangle with Flat Top, 2mm x 1.6mm; Supplier 1: Digi-Key; RoHS: RoHS Compliant; Category: Optoelectronics; Stock 1: 11785; Pricing 1: 1=0.64, 10=0.49, 100=0.3534, 250=0.31352, 500=0.2679, 1000=0.2109 (USD); Wavelength - Dominant: -; Package / Case: 1206 (3216 Metric); Size / Dimension: 3.20mm L x 1.60mm W; Height: 1.10mm; Mounting Type: Surface Mount; Packaging: Cut Tape (CT); Luminous Flux @ Current - Test: -; ComponentLink1URL: http://www.lumex.com/specs/SML-LX1206SUGC-TR.pdf; ComponentLink1Description: http://www.lumex.com/specs/SML-LX1206SUGC-TR.pdf; Supplier Part Number 1: 67-1698-1-ND; Load Status: *
R9 R10 R13 R14 = ERJ-PB3B2200V: RES SMD 220 OHM 0.1% 1/5W 0603; Manufacturer: Panasonic Electronic Components; Temperature Coefficient: ±50ppm/°C; Supplier 1: Digi-Key; Manufacturer Part Number: ERJ-PB3B2200V; RoHS: RoHS Compliant; Category: Resistors; Stock 1: 4143; Pricing 1: 1=0.24, 10=0.204, 25=0.1488, 50=0.1078, 100=0.0799, 250=0.06136, 500=0.04834, 1000=0.03346 (USD); Packaging: Cut Tape (CT); Part Status: Active; Tolerance: ±0.1%; Composition: Thick Film; Features: Automotive AEC-Q200, Pulse Withstanding; Operating Temperature: -55°C ~ 155°C; Package / Case: 0603 (1608 Metric); Supplier Device Package: 0603; Size / Dimension: 0.063" L x 0.032" W (1.60mm x 0.80mm); Height - Seated (Max): 0.022" (0.55mm); Failure Rate: -; ComponentLink1URL: https://industrial.panasonic.com/cdbs/www-data/pdf/RDM0000/AOA0000C328.pdf; ComponentLink1Description: https://industrial.panasonic.com/cdbs/www-data/pdf/RDM0000/AOA0000C328.pdf; Supplier Part Number 1: P19894CT-ND
  R9 R10 R14: Load Status: *
R11 R12 R15 R16 = ERJ-3GEYJ103V: as R33 on sheet Audio_Output_Headphone; Supplier 1: Digi-Key; Manufacturer Part Number: ERJ-3GEYJ103V; RoHS: RoHS Compliant; Category: Resistors; Stock 1: 16219504; Pricing 1: 1=0.02, 50=0.0092, 100=0.007, 250=0.0052, 500=0.00384, 1000=0.00256 (USD); Composition: Thick Film; Features: -; Tolerance: ±5%; Package / Case: 0603 (1608 Metric); Size / Dimension: 0.063" L x 0.031" W (1.60mm x 0.80mm); Height: 0.022" (0.55mm); Number of Terminations: 2; Packaging: Cut Tape (CT); ComponentLink1URL: http://industrial.panasonic.com/www-cgi/jvcr13pz.cgi?E+PZ+3+AOA0001+ERJ3GEYJ103V+7+WW; ComponentLink1Description: http://industrial.panasonic.com/www-cgi/jvcr13pz.cgi?E+PZ+3+AOA0001+ERJ3GEYJ103V+7+WW; Supplier Part Number 1: P10KGCT-ND; Load Status: *
SW1-SW4 = EG1218: Manufacturer: E-Switch; Contact Timing: Non-Shorting (BBM); Switch Function: On-On; Current Rating: 200mA (DC); Voltage Rating - DC: 30V; Actuator Type: Standard; Actuator Length: 2.00mm; Switch Travel: 2.50mm; Operating Force: 250gf; LatestRevisionDate: 17-Jul-2002; LatestRevisionNote: Re-released for DXP Platform.; Publisher: Altium Limited; Supplier 1: Digi-Key; RoHS: RoHS Compliant; Category: Switches; Stock 1: 22149; Pricing 1: 1=0.58, 10=0.559, 25=0.5476, 50=0.4894, 100=0.466, 250=0.45436, 500=0.38446, 1000=0.3728 (USD); Packaging: Bulk; Part Status: Active; Circuit: SPDT; Voltage Rating - AC: -; Contact Material: Copper Alloy; Contact Finish: Silver; Mounting Type: Through Hole; Termination Style: PC Pin; Features: -; Actuator Material: -; Operating Temperature: -20°C ~ 70°C; Mechanical Life: -; Electrical Life: -; ComponentLink1URL: http://spec_sheets.e-switch.com/specs/P040040.pdf; ComponentLink1Description: http://spec_sheets.e-switch.com/specs/P040040.pdf; Supplier Part Number 1: EG1903-ND; Manufacturer Part Number: EG1218; Load Status: *

## Sheet FPGA_Connectors.SchDoc: FPGA Connectors
size 279 x 215 mm; DrawnBy: Connor Dack; Engineer: Connor Dack; DocumentNumber: 6; Revision: 1.0; SheetNumber: 6; SheetTotal: 11
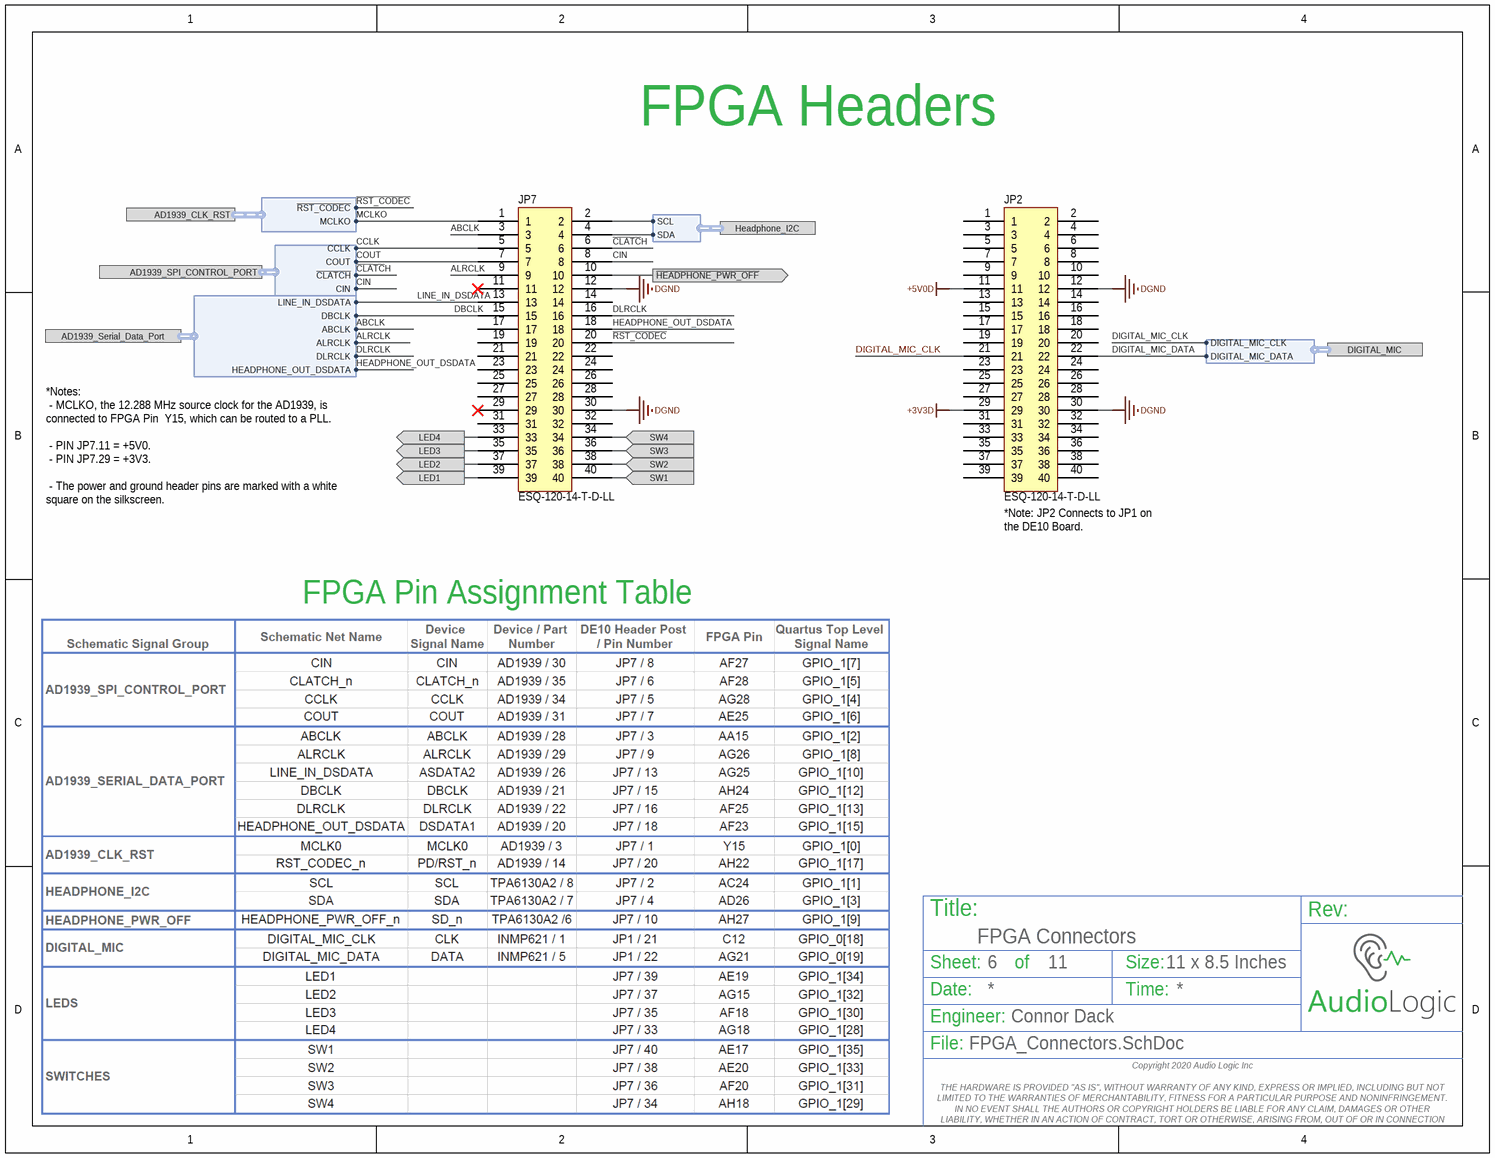
[diagram p6: FPGA_Connectors.SchDoc]

### Parts
JP2  ESQ-120-14-T-D-LL  [ESQ-120-24-T-D-LL]
JP7  ESQ-120-14-T-D-LL  [ESQ-120-24-T-D-LL]

### Ports
AD1939_CLK_RST (harness AD1939_CLK_RST), AD1939_Serial_Data_Port (harness AD19319_Serial_Data_Port), AD1939_SPI_CONTROL_PORT (harness SPI_Audio_Codec), DIGITAL_MIC (harness Digital_Mic), Headphone_I2C (harness I2C_Headphone), LED1 (out), LED2 (out), LED3 (out), LED4 (out), SW1 (in), SW2 (in), SW3 (in), SW4 (in), ~{HEADPHONE_PWR_OFF} (out)

### Harnesses
I2C_Headphone: SDA, SCL
SPI_Audio_Codec: CIN, COUT, CCLK, ~{CLATCH}
AD19319_Serial_Data_Port: ABCLK, ALRCLK, LINE_IN_DSDATA, DLRCLK, DBCLK, HEADPHONE_OUT_DSDATA
Digital_Mic: DIGITAL_MIC_CLK, DIGITAL_MIC_DATA
AD1939_CLK_RST: ~{RST_CODEC}, MCLKO

### Nets
+3V3D: JP2.29
+5V0D: JP2.11
DGND: JP2.12 JP2.30 JP7.12 JP7.30  [project net AGND]
~{CLATC}H: JP7.6 ; port AD1939_SPI_CONTROL_PORT.~{CLATCH}
ABCLK: JP7.3 ; port AD1939_Serial_Data_Port.ABCLK
ALRCLK: JP7.9 ; port AD1939_Serial_Data_Port.ALRCLK
CCLK: JP7.5 ; port AD1939_SPI_CONTROL_PORT.CCLK
CIN: JP7.8 ; port AD1939_SPI_CONTROL_PORT.CIN
COUT: JP7.7 ; port AD1939_SPI_CONTROL_PORT.COUT
DBCLK: JP7.15 ; port AD1939_Serial_Data_Port.DBCLK
DIGITAL_MIC_CLK: JP2.21 ; port DIGITAL_MIC.DIGITAL_MIC_CLK
DIGITAL_MIC_DATA: JP2.22 ; port DIGITAL_MIC.DIGITAL_MIC_DATA
DLRCLK: JP7.16 ; port AD1939_Serial_Data_Port.DLRCLK
~{HEADPHONE_PWR_OFF}: JP7.10 ; port ~{HEADPHONE_PWR_OFF}
HEADPHONE_OUT_DSDATA: JP7.18 ; port AD1939_Serial_Data_Port.HEADPHONE_OUT_DSDATA
LED1: JP7.39 ; port LED1
LED2: JP7.37 ; port LED2
LED3: JP7.35 ; port LED3
LED4: JP7.33 ; port LED4
LINE_IN_DSDATA: JP7.13 ; port AD1939_Serial_Data_Port.LINE_IN_DSDATA
MCLKO: JP7.1 ; port AD1939_CLK_RST.MCLKO
~{RST_CODEC}: JP7.20 ; port AD1939_CLK_RST.~{RST_CODEC}
SW1: JP7.40 ; port SW1
SW2: JP7.38 ; port SW2
SW3: JP7.36 ; port SW3
SW4: JP7.34 ; port SW4
NetJP7_2: JP7.2 ; port Headphone_I2C.SCL
NetJP7_4: JP7.4 ; port Headphone_I2C.SDA

Not connected (* = marked no-connect by the designer): JP2 1 2 3 4 5 6 7 8 9 10 13 14 15 16 17 18 19 20 23 24 25 26 27 28 31 32 33 34 35 36 37 38 39 40; JP7 11* 14 17 19 21 22 23 24 25 26 27 28 29* 31 32

### Notes on the sheet
- FPGA Headers
- *Notes:
  - MCLKO, the 12.288 MHz source clock for the AD1939, is connected to FPGA Pin  Y15, which can be routed to a PLL.
  - PIN JP7.11 = +5V0.
  - PIN JP7.29 = +3V3.
  - The power and ground header pins are marked with a white square on the silkscreen.
- (near JP2) *Note: JP2 Connects to JP1 on the DE10 Board.
- FPGA Pin Assignment Table
- Title:
- Sheet:
- of
- Size:
- 11 x 8.5 Inches
- Rev:
- Date:
- Engineer:
- Time:
- File:
- Copyright 2020 Audio Logic Inc
  THE HARDWARE IS PROVIDED "AS IS", WITHOUT WARRANTY OF ANY KIND, EXPRESS OR IMPLIED, INCLUDING BUT NOT LIMITED TO THE WARRANTIES OF MERCHANTABILITY, FITNESS FOR A PARTICULAR PURPOSE AND NONINFRINGEMENT. IN NO EVENT SHALL THE AUTHORS OR COPYRIGHT HOLDERS BE LIABLE FOR ANY CLAIM, DAMAGES OR OTHER LIABILITY, WHETHER IN AN ACTION OF CONTRACT, TORT OR OTHERWISE, ARISING FROM, OUT OF OR IN CONNECTION WITH THE HARDWARE OR THE USE OR OTHER DEALINGS IN THE HARDWARE.

### Library data of the parts
JP2 JP7 = CON_TH_0D100P_2x20: Female to Male 0D100P 2x20 Connector; Manufacturer: Samtec; LatestRevisionDate: 17-Jul-2002; LatestRevisionNote: Re-released for DXP Platform.; Publisher: Altium Limited; Manufacturer Part Number: ESQ-120-14-T-D-LL; Supplier 1: Samtec; Supplier Part Number 1: ESQ-120-14-T-D-LL; Load Status: *